# EAGLE schematic Power Distribution Board-B1 (EAGLE 9.6.2)

## Sheet 1 of 5
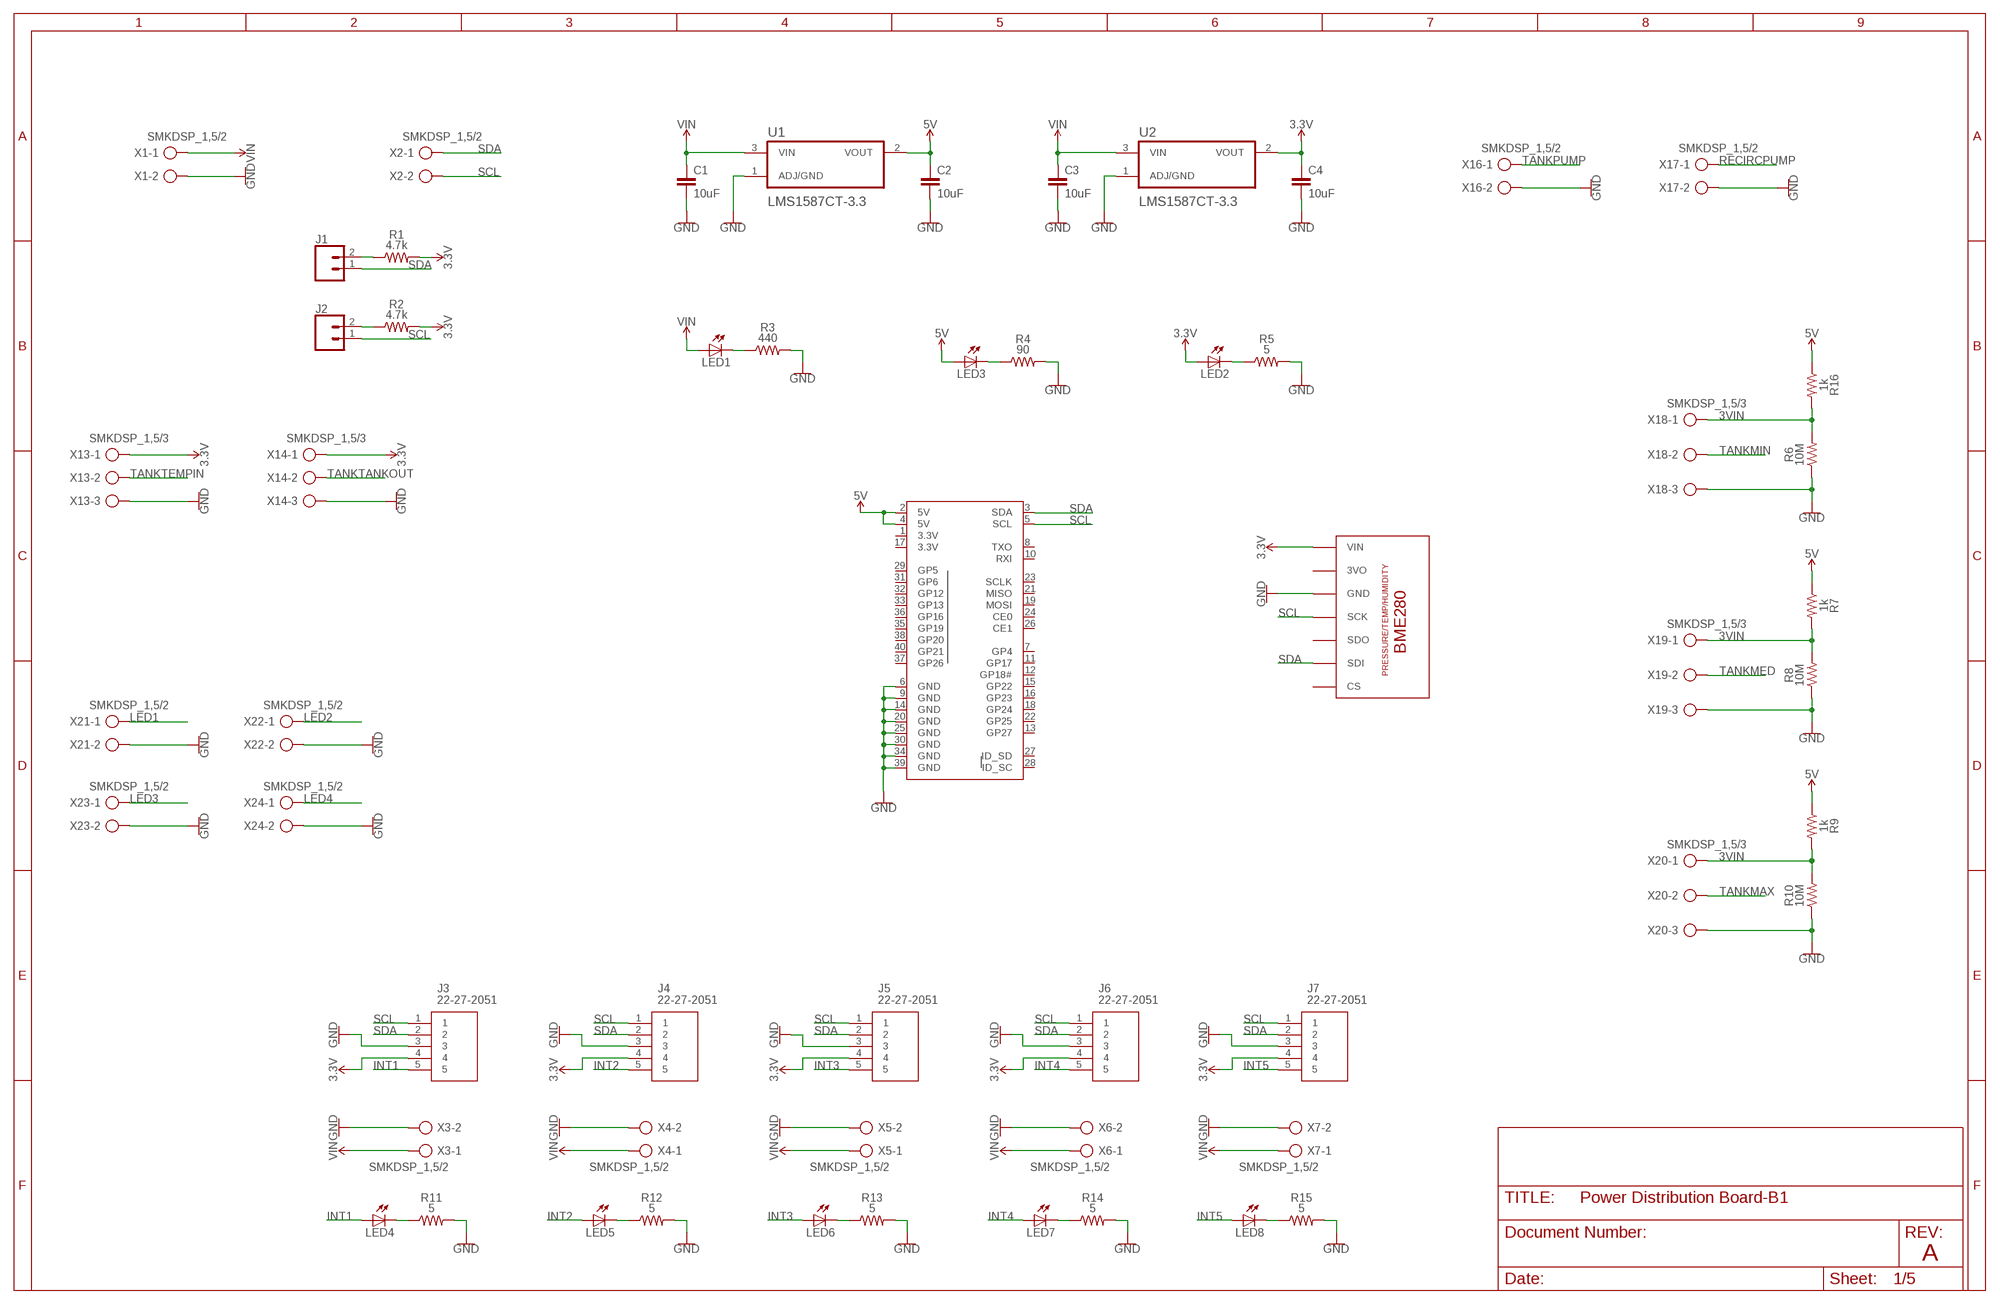
[diagram p0: schematic, sheet 1]

### Parts
C1  10uF  22PF-PTH-2.54MM-200V-5%  [CAP-PTH-2.54]
C2  10uF  22PF-PTH-2.54MM-200V-5%  [CAP-PTH-2.54]
C3  10uF  22PF-PTH-2.54MM-200V-5%  [CAP-PTH-2.54]
C4  10uF  22PF-PTH-2.54MM-200V-5%  [CAP-PTH-2.54]
J1  CONN_02  [1X02]
J2  CONN_02  [1X02]
J3  22-27-2051  [HDRV5W64P0X254_1X5_1270X580X12]
J4  22-27-2051  [HDRV5W64P0X254_1X5_1270X580X12]
J5  22-27-2051  [HDRV5W64P0X254_1X5_1270X580X12]
J6  22-27-2051  [HDRV5W64P0X254_1X5_1270X580X12]
J7  22-27-2051  [HDRV5W64P0X254_1X5_1270X580X12]
LED1  LED5MM  [LED5MM]
LED2  LED5MM  [LED5MM]
LED3  LED5MM  [LED5MM]
LED4  LED5MM  [LED5MM]
LED5  LED5MM  [LED5MM]
LED6  LED5MM  [LED5MM]
LED7  LED5MM  [LED5MM]
LED8  LED5MM  [LED5MM]
R1  4.7k  1MOHM-HORIZ-1/4W-5%  [AXIAL-0.3]
R2  4.7k  1MOHM-HORIZ-1/4W-5%  [AXIAL-0.3]
R3  440  1MOHM-HORIZ-1/4W-5%  [AXIAL-0.3]
R4  90  1MOHM-HORIZ-1/4W-5%  [AXIAL-0.3]
R5  5  1MOHM-HORIZ-1/4W-5%  [AXIAL-0.3]
R6  10M  1MOHM-HORIZ-1/4W-5%  [AXIAL-0.3]
R7  1k  1MOHM-HORIZ-1/4W-5%  [AXIAL-0.3]
R8  10M  1MOHM-HORIZ-1/4W-5%  [AXIAL-0.3]
R9  1k  1MOHM-HORIZ-1/4W-5%  [AXIAL-0.3]
R10  10M  1MOHM-HORIZ-1/4W-5%  [AXIAL-0.3]
R11  5  1MOHM-HORIZ-1/4W-5%  [AXIAL-0.3]
R12  5  1MOHM-HORIZ-1/4W-5%  [AXIAL-0.3]
R13  5  1MOHM-HORIZ-1/4W-5%  [AXIAL-0.3]
R14  5  1MOHM-HORIZ-1/4W-5%  [AXIAL-0.3]
R15  5  1MOHM-HORIZ-1/4W-5%  [AXIAL-0.3]
R16  1k  1MOHM-HORIZ-1/4W-5%  [AXIAL-0.3]
U1  LMS1587CT-3.3  [TO254P1054X470X1955-3]
U2  LMS1587CT-3.3  [TO254P1054X470X1955-3]
U$5  BME280  [BME280]
X1  SMKDSP_1,5/2  [SMKDSP_1,5/2]
X2  SMKDSP_1,5/2  [SMKDSP_1,5/2]
X3  SMKDSP_1,5/2  [SMKDSP_1,5/2]
X4  SMKDSP_1,5/2  [SMKDSP_1,5/2]
X5  SMKDSP_1,5/2  [SMKDSP_1,5/2]
X6  SMKDSP_1,5/2  [SMKDSP_1,5/2]
X7  SMKDSP_1,5/2  [SMKDSP_1,5/2]
X13  SMKDSP_1,5/3  [SMKDSP_1,5/3]
X14  SMKDSP_1,5/3  [SMKDSP_1,5/3]
X15  RASPBERRYPI-40-PIN-GPIO_PTH  [2X20_SHROUDED]
X16  SMKDSP_1,5/2  [SMKDSP_1,5/2]
X17  SMKDSP_1,5/2  [SMKDSP_1,5/2]
X18  SMKDSP_1,5/3  [SMKDSP_1,5/3]
X19  SMKDSP_1,5/3  [SMKDSP_1,5/3]
X20  SMKDSP_1,5/3  [SMKDSP_1,5/3]
X21  SMKDSP_1,5/2  [SMKDSP_1,5/2]
X22  SMKDSP_1,5/2  [SMKDSP_1,5/2]
X23  SMKDSP_1,5/2  [SMKDSP_1,5/2]
X24  SMKDSP_1,5/2  [SMKDSP_1,5/2]

### Nets
3.3V: C4.1 J3.4 J4.4 J5.4 J6.4 J7.4 LED2.A R1.P$2 R2.P$2 U2.2(VOUT) U$5.VIN X13.1 X14.1 ; also sheet 2,3,4,5
3VIN: R6.P$2 R7.P$2 R8.P$2 R9.P$2 R10.P$2 R16.P$2 X18.1 X19.1 X20.1
5V: C2.1 LED3.A R7.P$1 R9.P$1 R16.P$1 U1.2(VOUT) X15.2(5V) X15.4(5V)
GND: C1.2 C2.2 C3.2 C4.2 J3.3 J4.3 J5.3 J6.3 J7.3 R3.P$2 R4.P$2 R5.P$2 R6.P$1 R8.P$1 R10.P$1 R11.P$2 R12.P$2 R13.P$2 R14.P$2 R15.P$2 U1.1(ADJ/GND) U2.1(ADJ/GND) U$5.GND X1.2 X3.2 X4.2 X5.2 X6.2 X7.2 X13.3 X14.3 X15.6(GND) X15.9(GND) X15.14(GND) X15.20(GND) X15.25(GND) X15.30(GND) X15.34(GND) X15.39(GND) X16.2 X17.2 X18.3 X19.3 X20.3 X21.2 X22.2 X23.2 X24.2 ; also sheet 2,3,4,5
INT1: J3.5 LED4.A
INT2: J4.5 LED5.A
INT3: J5.5 LED6.A
INT4: J6.5 LED7.A
INT5: J7.5 LED8.A
LED1: X21.1
LED2: X22.1
LED3: X23.1
LED4: X24.1
N$1: J1.2 R1.P$1
N$2: J2.2 R2.P$1
N$3: LED2.K(C) R5.P$1
N$4: LED1.K(C) R3.P$1
N$5: LED3.K(C) R4.P$1
N$6: LED4.K(C) R11.P$1
N$7: LED5.K(C) R12.P$1
N$8: LED6.K(C) R13.P$1
N$9: LED7.K(C) R14.P$1
N$10: LED8.K(C) R15.P$1
RECIRCPUMP: X17.1
SCL: J2.1 J3.1 J4.1 J5.1 J6.1 J7.1 U$5.SCK X2.2 X15.5(SCL) ; also sheet 2,3,4,5
SDA: J1.1 J3.2 J4.2 J5.2 J6.2 J7.2 U$5.SDI X2.1 X15.3(SDA) ; also sheet 2,3,4,5
TANKMAX: X20.2
TANKMED: X19.2
TANKMIN: X18.2
TANKPUMP: X16.1
TANKTANKOUT: X14.2
TANKTEMPIN: X13.2
VIN: C1.1 C3.1 LED1.A U1.3(VIN) U2.3(VIN) X1.1 X3.1 X4.1 X5.1 X6.1 X7.1
Unconnected: U$5.3VO U$5.CS U$5.SDO X15.7(GP4) X15.8(TXO) X15.10(RXI) X15.11(GP17) X15.12(GP18#) X15.13(GP27) X15.15(GP22) X15.16(GP23) X15.18(GP24) X15.19(MOSI) X15.21(MISO) X15.22(GP25) X15.23(SCLK) X15.24(CE0) X15.26(CE1) X15.27(ID_SD) X15.28(ID_SC) X15.29(GP5) X15.31(GP6) X15.32(GP12) X15.33(GP13) X15.35(GP19) X15.36(GP16) X15.37(GP26) X15.38(GP20) X15.40(GP21)

### Notes on the sheet
- A

## Sheet 2 of 5
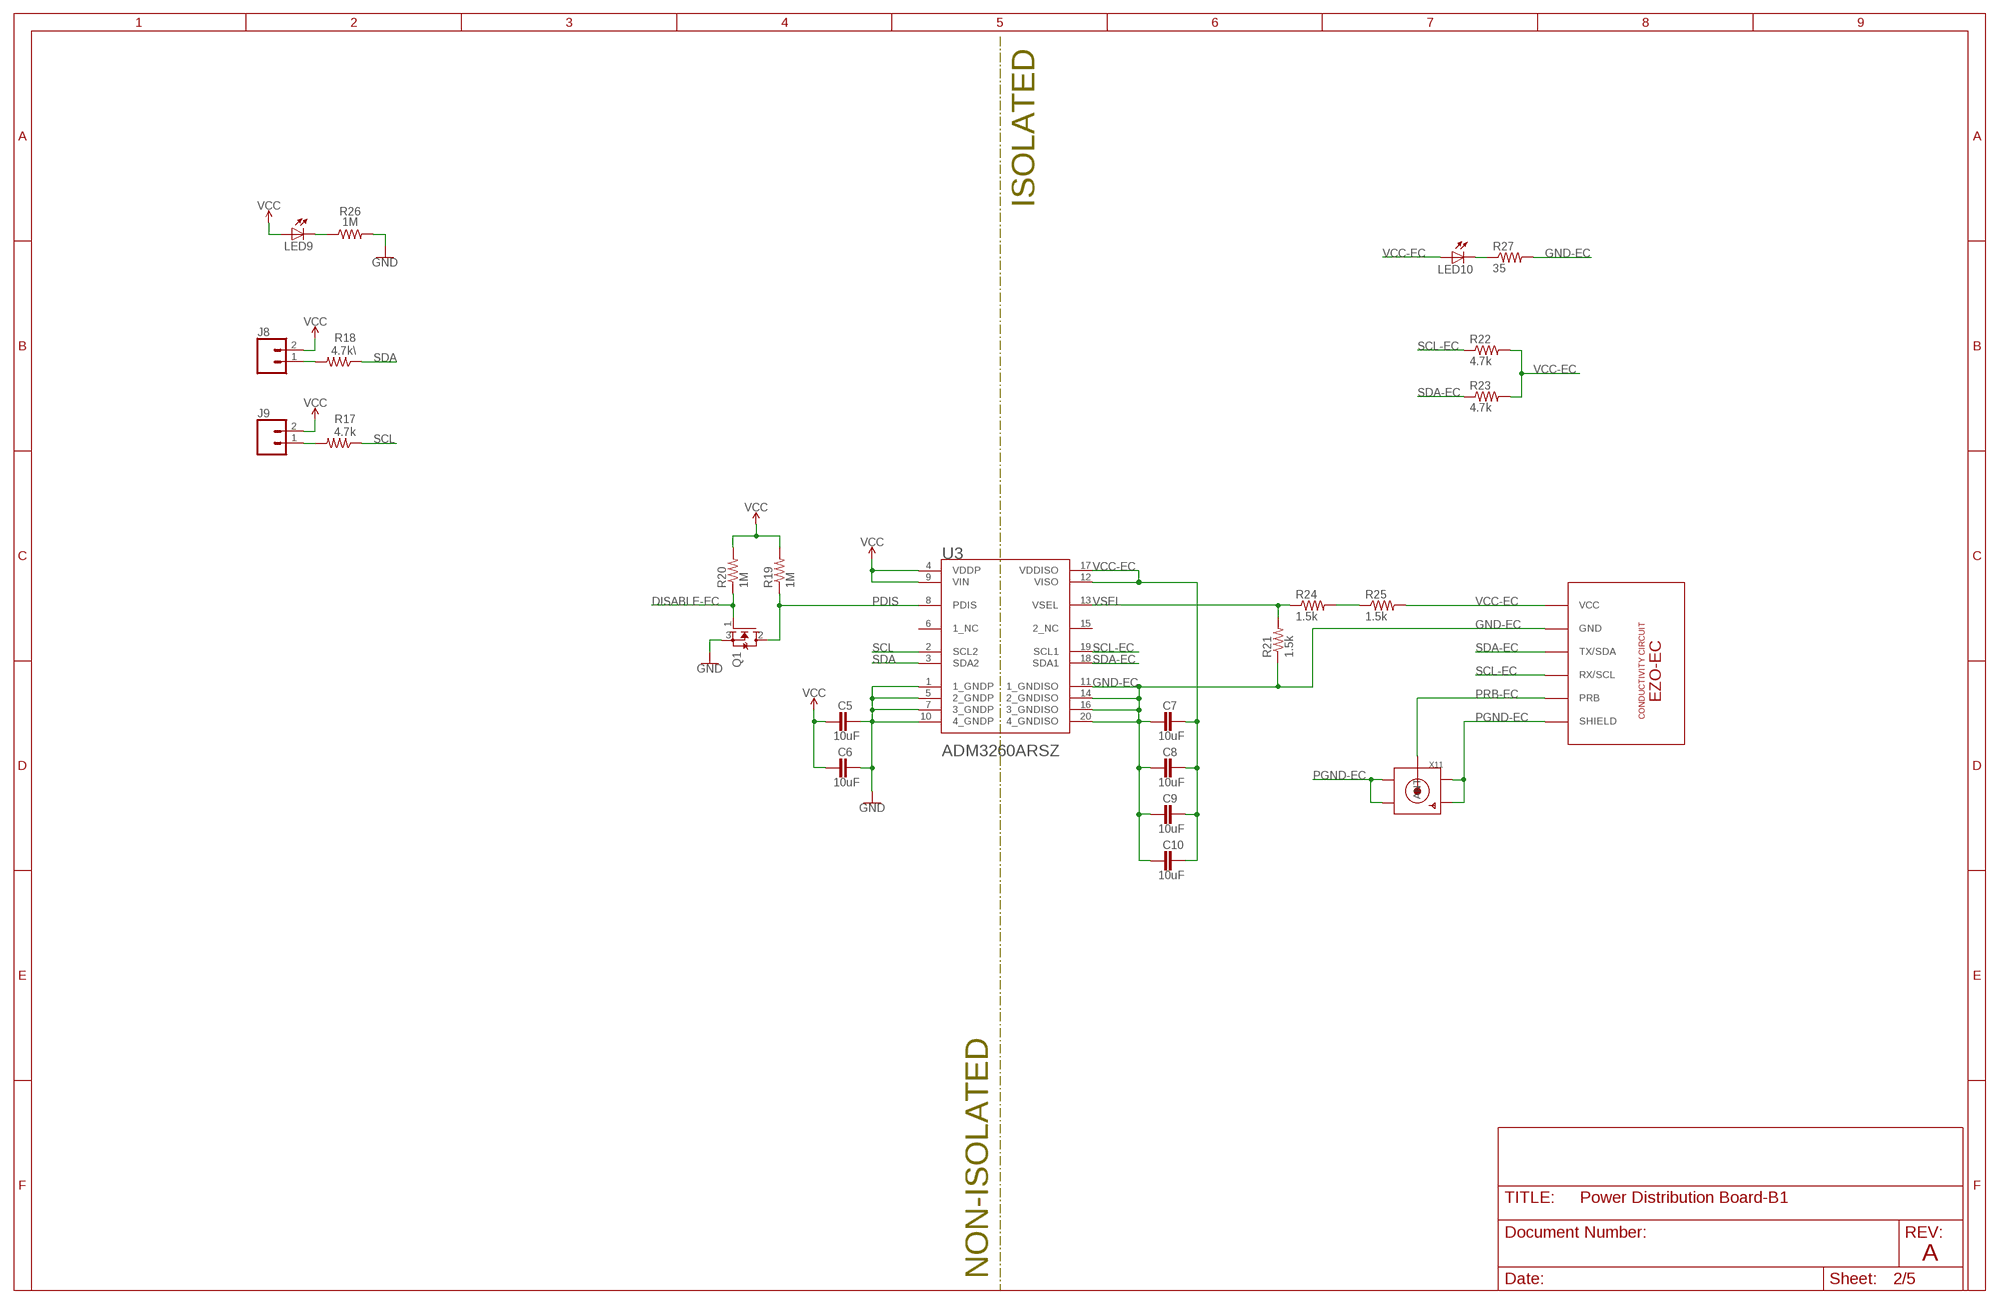
[diagram p1: schematic, sheet 2]

### Parts
C5  10uF  22PF-PTH-2.54MM-200V-5%  [CAP-PTH-2.54]
C6  10uF  22PF-PTH-2.54MM-200V-5%  [CAP-PTH-2.54]
C7  10uF  22PF-PTH-2.54MM-200V-5%  [CAP-PTH-2.54]
C8  10uF  22PF-PTH-2.54MM-200V-5%  [CAP-PTH-2.54]
C9  10uF  22PF-PTH-2.54MM-200V-5%  [CAP-PTH-2.54]
C10  10uF  22PF-PTH-2.54MM-200V-5%  [CAP-PTH-2.54]
J8  CONN_02  [1X02]
J9  CONN_02  [1X02]
LED9  LED5MM  [LED5MM]
LED10  LED5MM  [LED5MM]
Q1  MOSFET-NGDS_TO220V  [TO220V]
R17  4.7k  1MOHM-HORIZ-1/4W-5%  [AXIAL-0.3]
R18  4.7k\  1MOHM-HORIZ-1/4W-5%  [AXIAL-0.3]
R19  1M  1MOHM-HORIZ-1/4W-5%  [AXIAL-0.3]
R20  1M  1MOHM-HORIZ-1/4W-5%  [AXIAL-0.3]
R21  1.5k  1MOHM-HORIZ-1/4W-5%  [AXIAL-0.3]
R22  4.7k  1MOHM-HORIZ-1/4W-5%  [AXIAL-0.3]
R23  4.7k  1MOHM-HORIZ-1/4W-5%  [AXIAL-0.3]
R24  1.5k  1MOHM-HORIZ-1/4W-5%  [AXIAL-0.3]
R25  1.5k  1MOHM-HORIZ-1/4W-5%  [AXIAL-0.3]
R26  1M  1MOHM-HORIZ-1/4W-5%  [AXIAL-0.3]
R27  35  1MOHM-HORIZ-1/4W-5%  [AXIAL-0.3]
U3  ANALOG_DEVICES_INC_ADM3260ARSZANALOG_DEVICES_INC_ADM3260ARSZ_0_0  [ANALOG_DEVICES_INC_ADM3260ARSZ_0]
U$1  EZO-EC  [EZO-EC]
X11  SMACONNECTOR  [SMA90_DIP]

### Nets
3.3V: C5.1 C6.1 LED9.A R19.P$2 R20.P$2 U3.4(VDDP) U3.9(VIN) ; supply symbol labelled VCC ; also sheet 1,3,4,5
DISABLE-EC: Q1.1(G) R20.P$1
GND: C5.2 C6.2 Q1.3(S) R26.P$2 U3.1(1_GNDP) U3.5(2_GNDP) U3.7(3_GNDP) U3.10(4_GNDP) ; also sheet 1,3,4,5
GND-EC: C7.1 C8.1 C9.1 C10.1 R21.P$1 R27.P$2 U3.11(1_GNDISO) U3.14(2_GNDISO) U3.16(3_GNDISO) U3.20(4_GNDISO) U$1.GND
N$12: J9.1 R17.P$2
N$13: R24.P$2 R25.P$1
N$14: LED9.K(C) R26.P$1
N$15: LED10.K(C) R27.P$1
N$18: J8.1 R18.P$2
PDIS: Q1.2(D) R19.P$1 U3.8(PDIS) ; also sheet 3,4,5
PGND-EC: U$1.SHIELD X11.GND1 X11.GND2 X11.GND3 X11.GND4
PRB-EC: U$1.PRB X11.ANTENNA(ANT)
SCL: R17.P$1 U3.2(SCL2) ; also sheet 1,3,4,5
SCL-EC: R22.P$1 U3.19(SCL1) U$1.RX/SCL
SDA: R18.P$1 U3.3(SDA2) ; also sheet 1,3,4,5
SDA-EC: R23.P$1 U3.18(SDA1) U$1.TX/SDA
VCC: J8.2 J9.2 ; also sheet 3,4,5
VCC-EC: C7.2 C8.2 C9.2 C10.2 LED10.A R22.P$2 R23.P$2 R25.P$2 U3.12(VISO) U3.17(VDDISO) U$1.VCC
VSEL: R21.P$2 R24.P$1 U3.13(VSEL) ; also sheet 3,4,5
Unconnected: U3.6(1_NC) U3.15(2_NC)

### Notes on the sheet
- ISOLATED
- A
- NON-ISOLATED

## Sheet 3 of 5
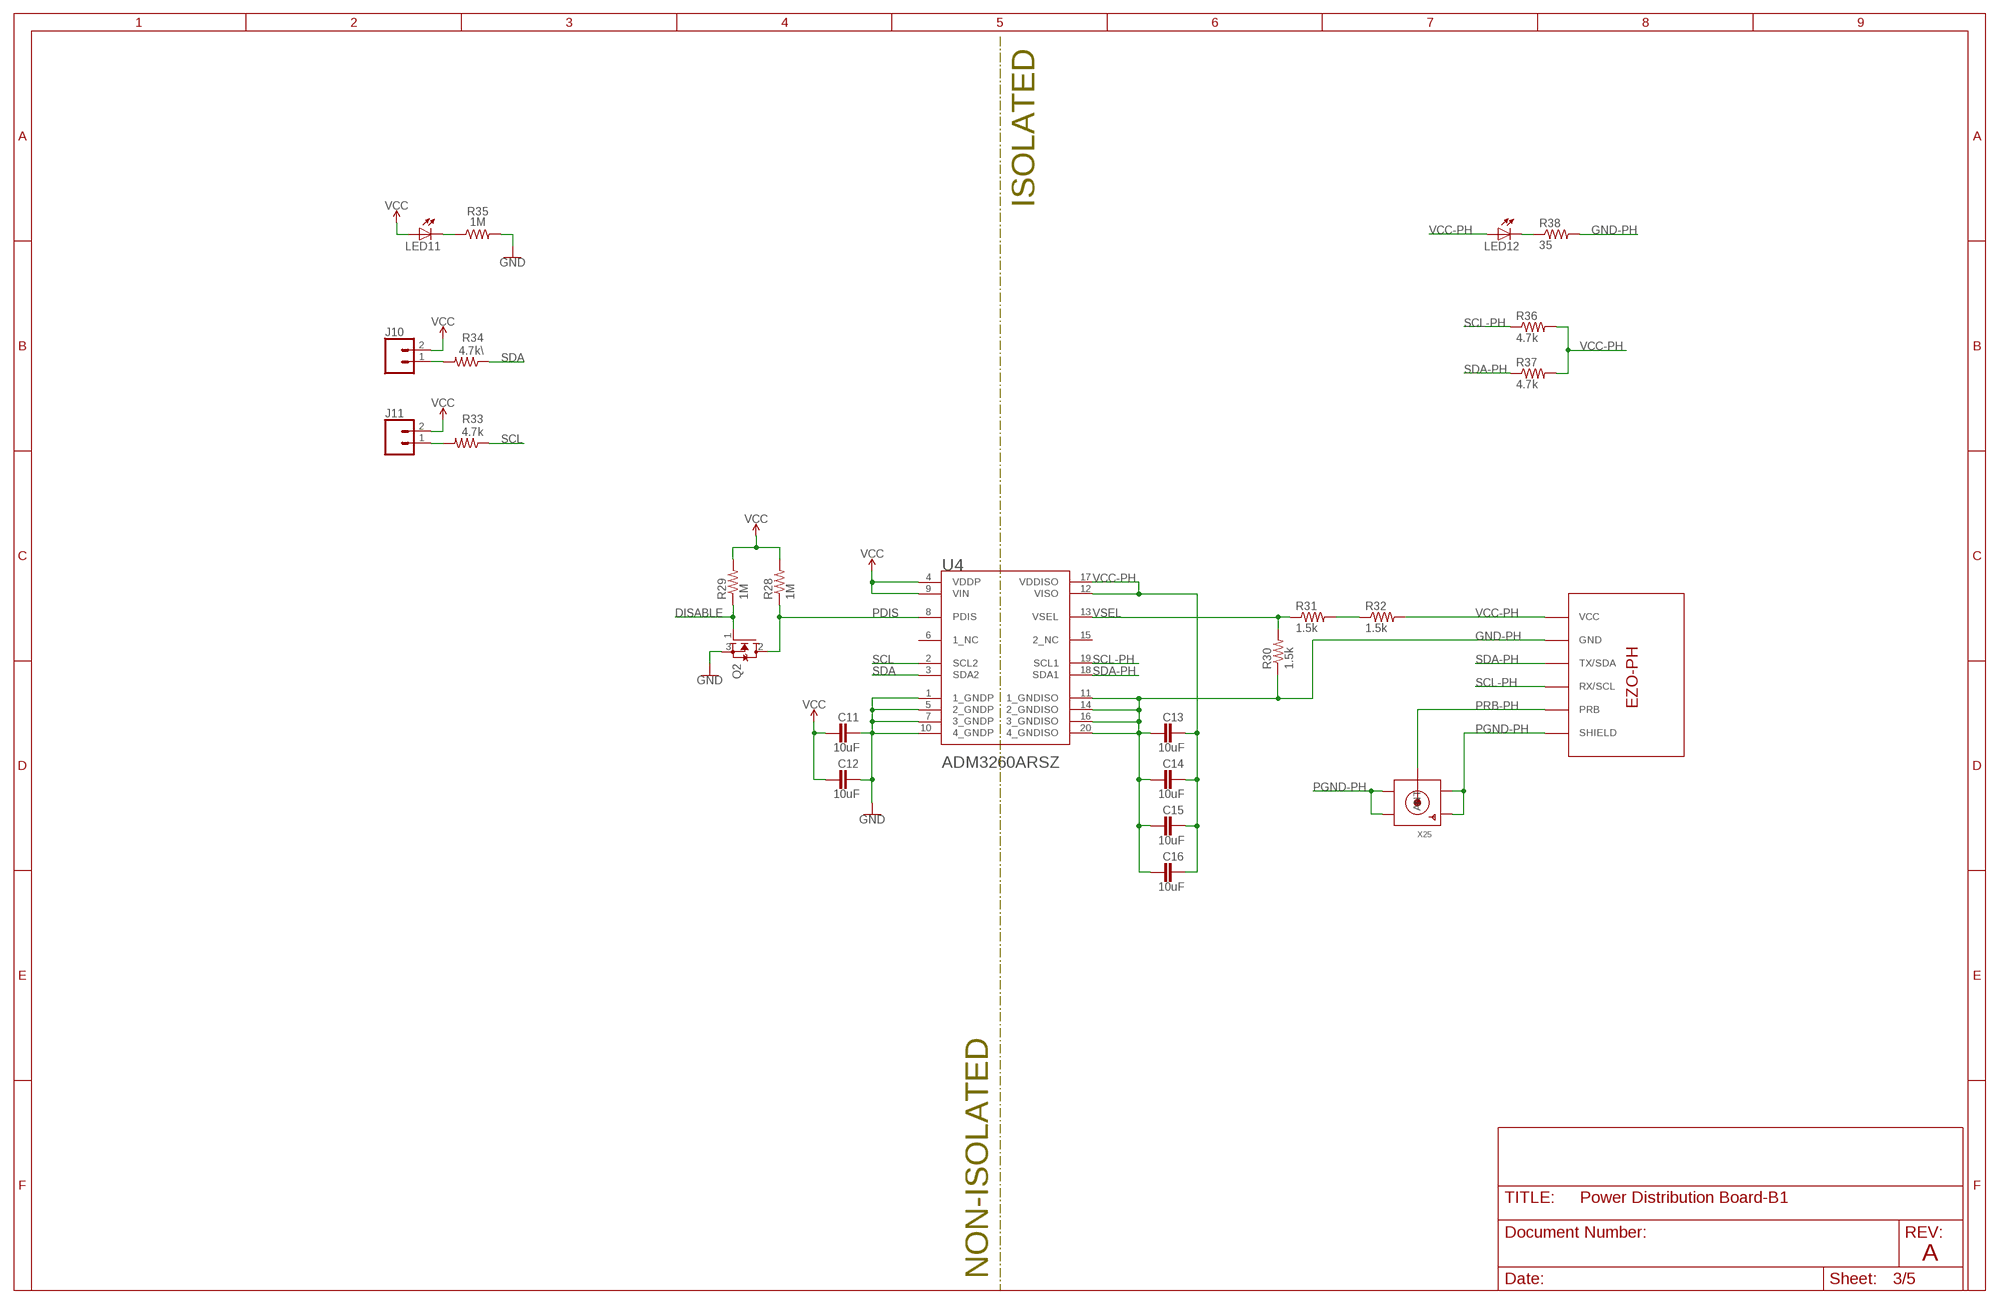
[diagram p2: schematic, sheet 3]

### Parts
C11  10uF  22PF-PTH-2.54MM-200V-5%  [CAP-PTH-2.54]
C12  10uF  22PF-PTH-2.54MM-200V-5%  [CAP-PTH-2.54]
C13  10uF  22PF-PTH-2.54MM-200V-5%  [CAP-PTH-2.54]
C14  10uF  22PF-PTH-2.54MM-200V-5%  [CAP-PTH-2.54]
C15  10uF  22PF-PTH-2.54MM-200V-5%  [CAP-PTH-2.54]
C16  10uF  22PF-PTH-2.54MM-200V-5%  [CAP-PTH-2.54]
J10  CONN_02  [1X02]
J11  CONN_02  [1X02]
LED11  LED5MM  [LED5MM]
LED12  LED5MM  [LED5MM]
Q2  MOSFET-NGDS_TO220V  [TO220V]
R28  1M  1MOHM-HORIZ-1/4W-5%  [AXIAL-0.3]
R29  1M  1MOHM-HORIZ-1/4W-5%  [AXIAL-0.3]
R30  1.5k  1MOHM-HORIZ-1/4W-5%  [AXIAL-0.3]
R31  1.5k  1MOHM-HORIZ-1/4W-5%  [AXIAL-0.3]
R32  1.5k  1MOHM-HORIZ-1/4W-5%  [AXIAL-0.3]
R33  4.7k  1MOHM-HORIZ-1/4W-5%  [AXIAL-0.3]
R34  4.7k\  1MOHM-HORIZ-1/4W-5%  [AXIAL-0.3]
R35  1M  1MOHM-HORIZ-1/4W-5%  [AXIAL-0.3]
R36  4.7k  1MOHM-HORIZ-1/4W-5%  [AXIAL-0.3]
R37  4.7k  1MOHM-HORIZ-1/4W-5%  [AXIAL-0.3]
R38  35  1MOHM-HORIZ-1/4W-5%  [AXIAL-0.3]
U4  ANALOG_DEVICES_INC_ADM3260ARSZANALOG_DEVICES_INC_ADM3260ARSZ_0_0  [ANALOG_DEVICES_INC_ADM3260ARSZ_0]
U$11  EZO-PH  [EZO-PH]
X25  SMACONNECTOR  [SMA90_DIP]

### Nets
3.3V: C11.1 C12.1 U4.4(VDDP) U4.9(VIN) ; supply symbol labelled VCC ; also sheet 1,2,4,5
DISABLE: Q2.1(G) R29.P$1 ; also sheet 4,5
GND: C11.2 C12.2 Q2.3(S) R35.P$2 U4.1(1_GNDP) U4.5(2_GNDP) U4.7(3_GNDP) U4.10(4_GNDP) ; also sheet 1,2,4,5
GND-PH: C13.1 C14.1 C15.1 C16.1 R30.P$1 R38.P$2 U4.11(1_GNDISO) U4.14(2_GNDISO) U4.16(3_GNDISO) U4.20(4_GNDISO) U$11.GND
N$16: LED11.K(C) R35.P$1
N$19: R31.P$2 R32.P$1
N$20: J11.1 R33.P$2
N$21: J10.1 R34.P$2
N$22: LED12.K(C) R38.P$1
PDIS: Q2.2(D) R28.P$1 U4.8(PDIS) ; also sheet 2,4,5
PGND-PH: U$11.SHIELD X25.GND1 X25.GND2 X25.GND3 X25.GND4
PRB-PH: U$11.PRB X25.ANTENNA(ANT)
SCL: R33.P$1 U4.2(SCL2) ; also sheet 1,2,4,5
SCL-PH: R36.P$1 U4.19(SCL1) U$11.RX/SCL
SDA: R34.P$1 U4.3(SDA2) ; also sheet 1,2,4,5
SDA-PH: R37.P$1 U4.18(SDA1) U$11.TX/SDA
VCC: J10.2 J11.2 LED11.A R28.P$2 R29.P$2 ; also sheet 2,4,5
VCC-PH: C13.2 C14.2 C15.2 C16.2 LED12.A R32.P$2 R36.P$2 R37.P$2 U4.12(VISO) U4.17(VDDISO) U$11.VCC
VSEL: R30.P$2 R31.P$1 U4.13(VSEL) ; also sheet 2,4,5
Unconnected: U4.6(1_NC) U4.15(2_NC)

### Notes on the sheet
- ISOLATED
- A
- NON-ISOLATED

## Sheet 4 of 5
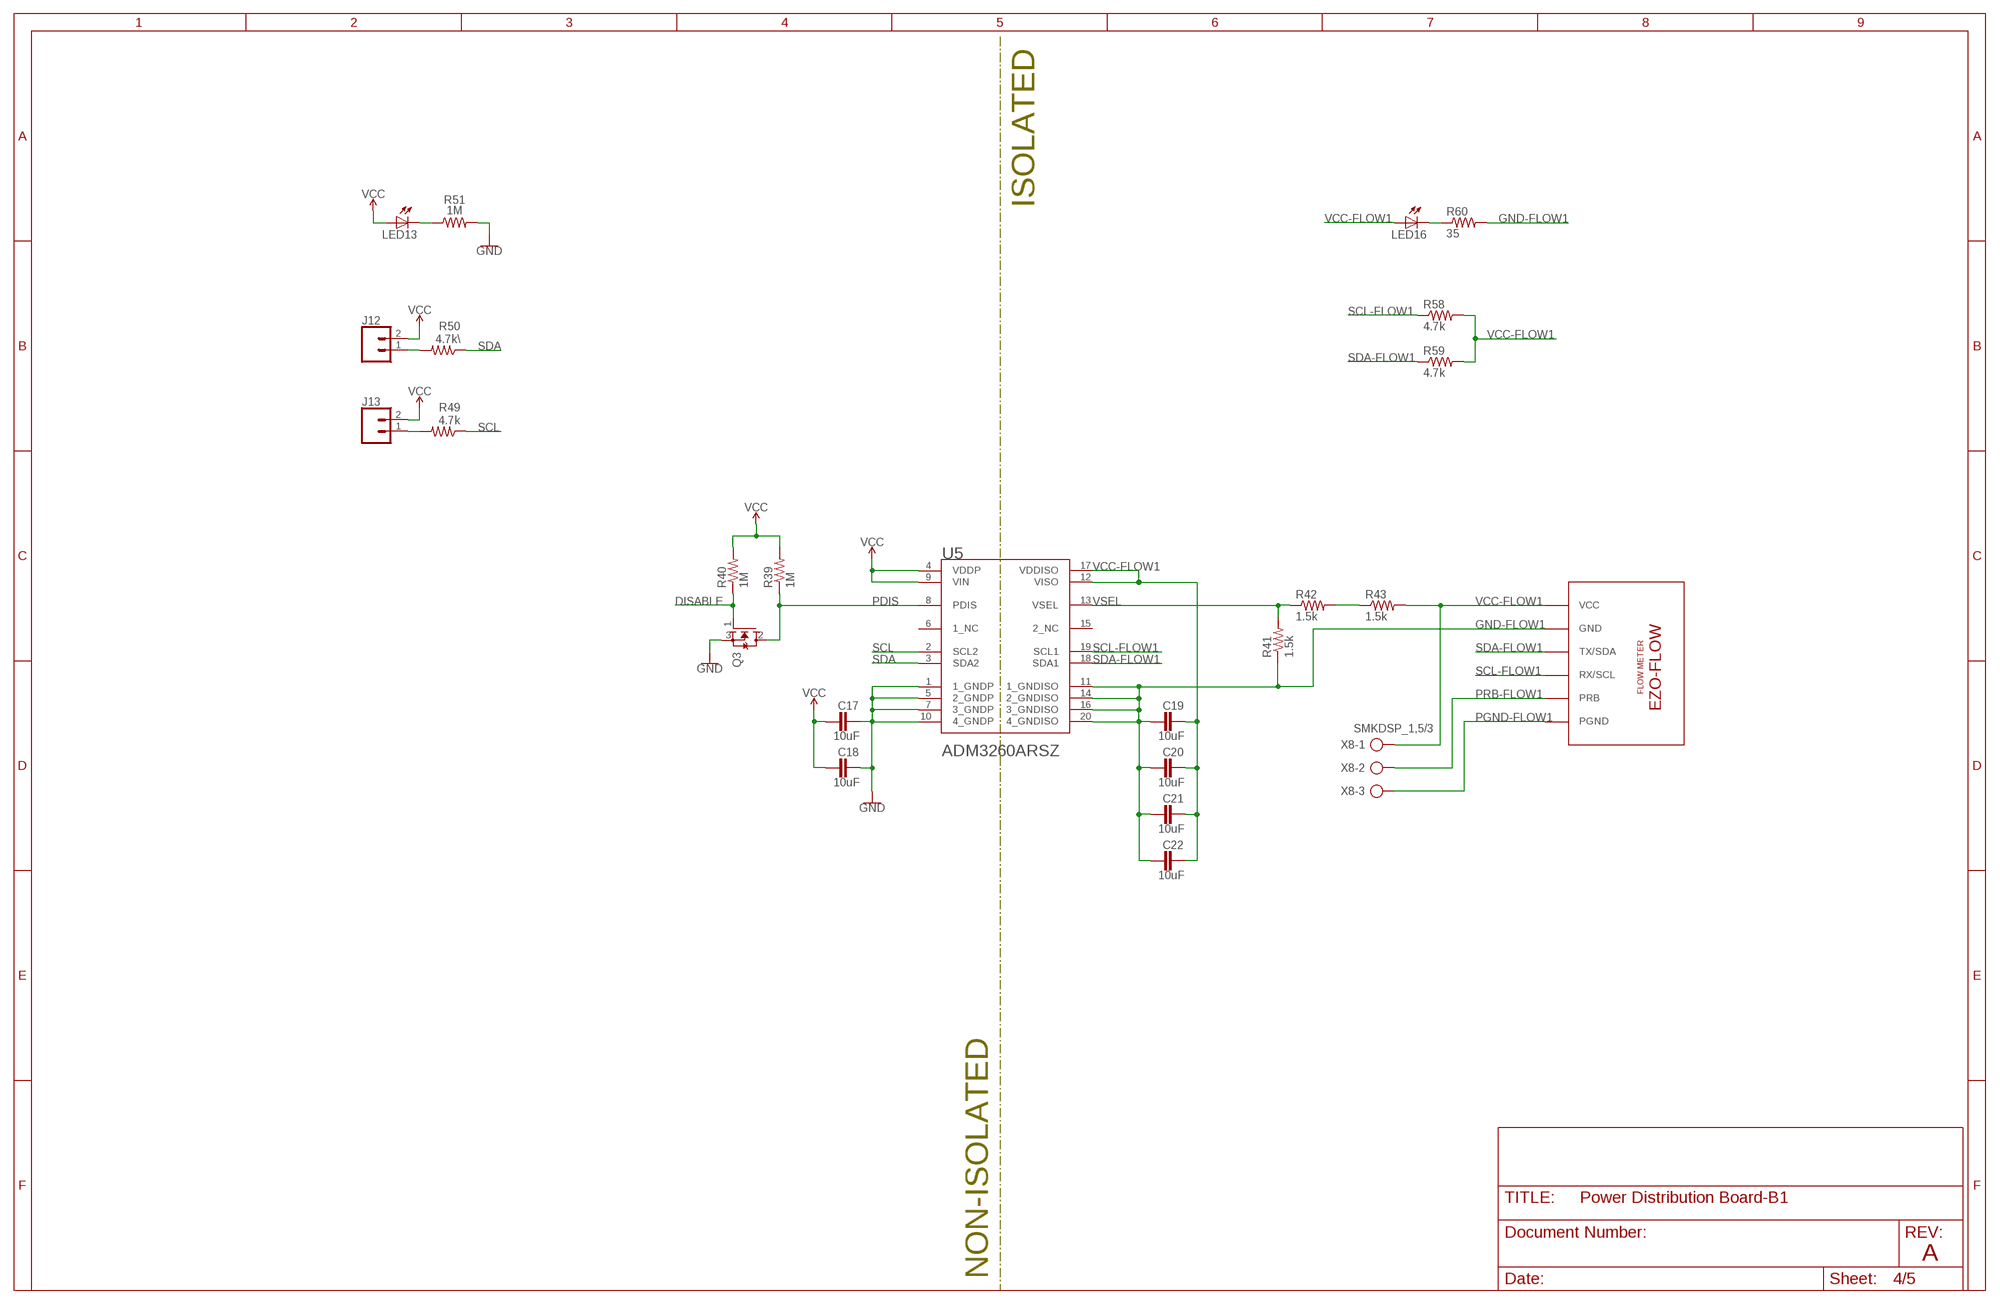
[diagram p3: schematic, sheet 4]

### Parts
C17  10uF  22PF-PTH-2.54MM-200V-5%  [CAP-PTH-2.54]
C18  10uF  22PF-PTH-2.54MM-200V-5%  [CAP-PTH-2.54]
C19  10uF  22PF-PTH-2.54MM-200V-5%  [CAP-PTH-2.54]
C20  10uF  22PF-PTH-2.54MM-200V-5%  [CAP-PTH-2.54]
C21  10uF  22PF-PTH-2.54MM-200V-5%  [CAP-PTH-2.54]
C22  10uF  22PF-PTH-2.54MM-200V-5%  [CAP-PTH-2.54]
J12  CONN_02  [1X02]
J13  CONN_02  [1X02]
LED13  LED5MM  [LED5MM]
LED16  LED5MM  [LED5MM]
Q3  MOSFET-NGDS_TO220V  [TO220V]
R39  1M  1MOHM-HORIZ-1/4W-5%  [AXIAL-0.3]
R40  1M  1MOHM-HORIZ-1/4W-5%  [AXIAL-0.3]
R41  1.5k  1MOHM-HORIZ-1/4W-5%  [AXIAL-0.3]
R42  1.5k  1MOHM-HORIZ-1/4W-5%  [AXIAL-0.3]
R43  1.5k  1MOHM-HORIZ-1/4W-5%  [AXIAL-0.3]
R49  4.7k  1MOHM-HORIZ-1/4W-5%  [AXIAL-0.3]
R50  4.7k\  1MOHM-HORIZ-1/4W-5%  [AXIAL-0.3]
R51  1M  1MOHM-HORIZ-1/4W-5%  [AXIAL-0.3]
R58  4.7k  1MOHM-HORIZ-1/4W-5%  [AXIAL-0.3]
R59  4.7k  1MOHM-HORIZ-1/4W-5%  [AXIAL-0.3]
R60  35  1MOHM-HORIZ-1/4W-5%  [AXIAL-0.3]
U5  ANALOG_DEVICES_INC_ADM3260ARSZANALOG_DEVICES_INC_ADM3260ARSZ_0_0  [ANALOG_DEVICES_INC_ADM3260ARSZ_0]
U$2  EZO-FLOW  [EZO-FLOW]
X8  SMKDSP_1,5/3  [SMKDSP_1,5/3]

### Nets
3.3V: C17.1 C18.1 LED13.A R39.P$2 R40.P$2 U5.4(VDDP) U5.9(VIN) ; supply symbol labelled VCC ; also sheet 1,2,3,5
DISABLE: Q3.1(G) R40.P$1 ; also sheet 3,5
GND: C17.2 C18.2 Q3.3(S) R51.P$2 U5.1(1_GNDP) U5.5(2_GNDP) U5.7(3_GNDP) U5.10(4_GNDP) ; also sheet 1,2,3,5
GND-FLOW1: C19.1 C20.1 C21.1 C22.1 R41.P$1 R60.P$2 U5.11(1_GNDISO) U5.14(2_GNDISO) U5.16(3_GNDISO) U5.20(4_GNDISO) U$2.GND
N$24: R42.P$2 R43.P$1
N$29: LED13.K(C) R51.P$1
N$30: J13.1 R49.P$2
N$31: J12.1 R50.P$2
N$36: LED16.K(C) R60.P$1
PDIS: Q3.2(D) R39.P$1 U5.8(PDIS) ; also sheet 2,3,5
PGND-FLOW1: U$2.PGND X8.3
PRB-FLOW1: U$2.PRB X8.2
SCL: R49.P$1 U5.2(SCL2) ; also sheet 1,2,3,5
SCL-FLOW1: R58.P$1 U5.19(SCL1) U$2.RX/SCL
SDA: R50.P$1 U5.3(SDA2) ; also sheet 1,2,3,5
SDA-FLOW1: R59.P$1 U5.18(SDA1) U$2.TX/SDA
VCC: J12.2 J13.2 ; also sheet 2,3,5
VCC-FLOW1: C19.2 C20.2 C21.2 C22.2 LED16.A R43.P$2 R58.P$2 R59.P$2 U5.12(VISO) U5.17(VDDISO) U$2.VCC X8.1
VSEL: R41.P$2 R42.P$1 U5.13(VSEL) ; also sheet 2,3,5
Unconnected: U5.6(1_NC) U5.15(2_NC)

### Notes on the sheet
- ISOLATED
- A
- NON-ISOLATED

## Sheet 5 of 5
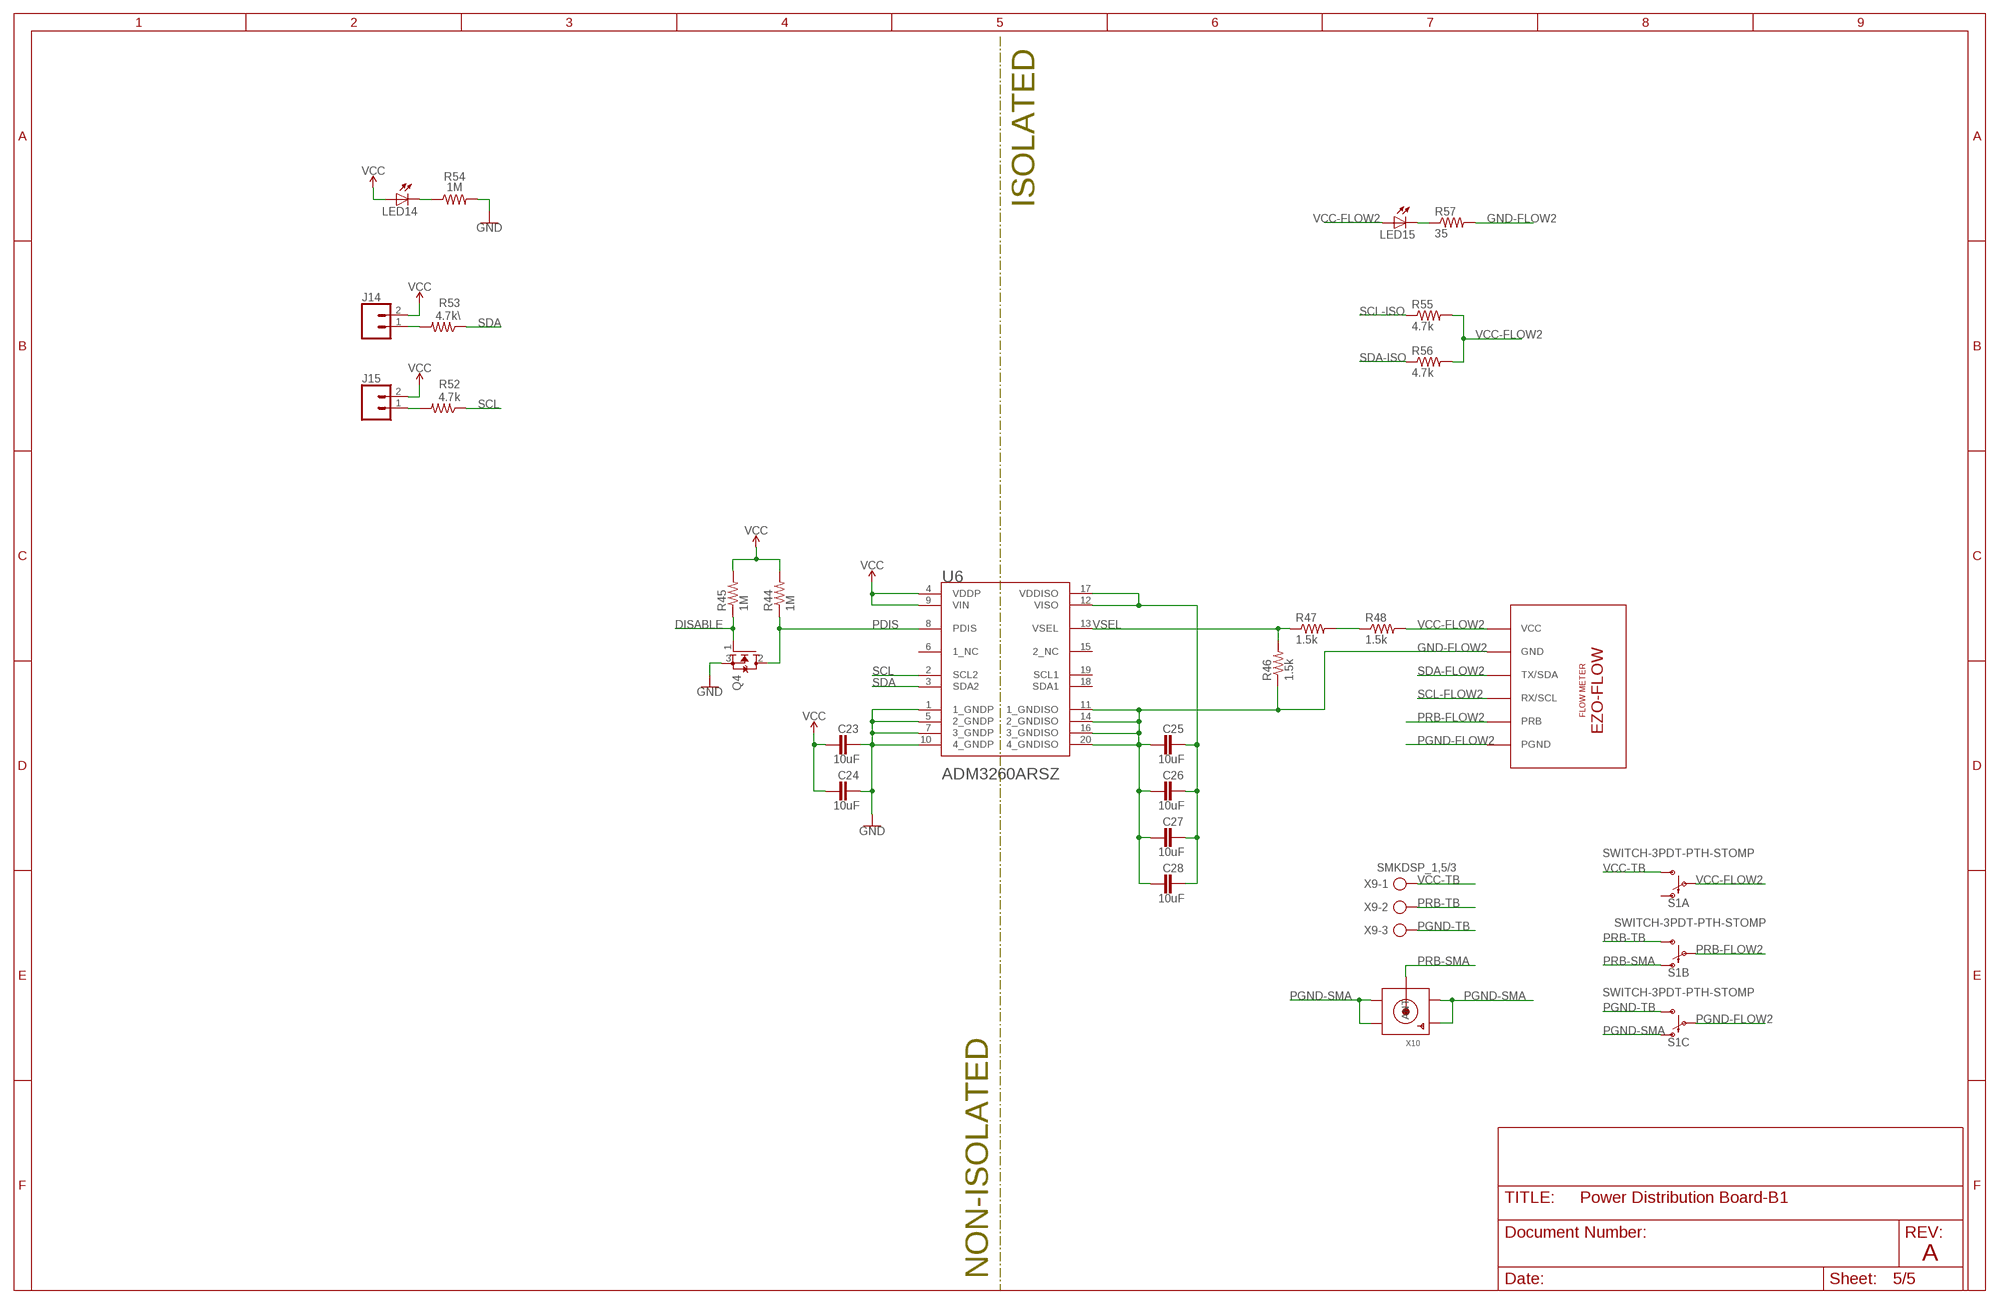
[diagram p4: schematic, sheet 5]

### Parts
C23  10uF  22PF-PTH-2.54MM-200V-5%  [CAP-PTH-2.54]
C24  10uF  22PF-PTH-2.54MM-200V-5%  [CAP-PTH-2.54]
C25  10uF  22PF-PTH-2.54MM-200V-5%  [CAP-PTH-2.54]
C26  10uF  22PF-PTH-2.54MM-200V-5%  [CAP-PTH-2.54]
C27  10uF  22PF-PTH-2.54MM-200V-5%  [CAP-PTH-2.54]
C28  10uF  22PF-PTH-2.54MM-200V-5%  [CAP-PTH-2.54]
J14  CONN_02  [1X02]
J15  CONN_02  [1X02]
LED14  LED5MM  [LED5MM]
LED15  LED5MM  [LED5MM]
Q4  MOSFET-NGDS_TO220V  [TO220V]
R44  1M  1MOHM-HORIZ-1/4W-5%  [AXIAL-0.3]
R45  1M  1MOHM-HORIZ-1/4W-5%  [AXIAL-0.3]
R46  1.5k  1MOHM-HORIZ-1/4W-5%  [AXIAL-0.3]
R47  1.5k  1MOHM-HORIZ-1/4W-5%  [AXIAL-0.3]
R48  1.5k  1MOHM-HORIZ-1/4W-5%  [AXIAL-0.3]
R52  4.7k  1MOHM-HORIZ-1/4W-5%  [AXIAL-0.3]
R53  4.7k\  1MOHM-HORIZ-1/4W-5%  [AXIAL-0.3]
R54  1M  1MOHM-HORIZ-1/4W-5%  [AXIAL-0.3]
R55  4.7k  1MOHM-HORIZ-1/4W-5%  [AXIAL-0.3]
R56  4.7k  1MOHM-HORIZ-1/4W-5%  [AXIAL-0.3]
R57  35  1MOHM-HORIZ-1/4W-5%  [AXIAL-0.3]
S1  SWITCH-3PDT-PTH-STOMP  [STOMP_SWITCH_3PDT]
U6  ANALOG_DEVICES_INC_ADM3260ARSZANALOG_DEVICES_INC_ADM3260ARSZ_0_0  [ANALOG_DEVICES_INC_ADM3260ARSZ_0]
U$4  EZO-FLOW  [EZO-FLOW]
X9  SMKDSP_1,5/3  [SMKDSP_1,5/3]
X10  SMACONNECTOR  [SMA90_DIP]

### Nets
3.3V: C23.1 C24.1 LED14.A R44.P$2 R45.P$2 U6.4(VDDP) U6.9(VIN) ; supply symbol labelled VCC ; also sheet 1,2,3,4
DISABLE: Q4.1(G) R45.P$1 ; also sheet 3,4
GND: C23.2 C24.2 Q4.3(S) R54.P$2 U6.1(1_GNDP) U6.5(2_GNDP) U6.7(3_GNDP) U6.10(4_GNDP) ; also sheet 1,2,3,4
GND-FLOW2: C25.1 C26.1 C27.1 C28.1 R46.P$1 R57.P$2 U6.11(1_GNDISO) U6.14(2_GNDISO) U6.16(3_GNDISO) U6.20(4_GNDISO) U$4.GND
N$27: R47.P$2 R48.P$1
N$28: C25.2 C26.2 C27.2 C28.2 U6.12(VISO) U6.17(VDDISO)
N$32: LED14.K(C) R54.P$1
N$33: J15.1 R52.P$2
N$34: J14.1 R53.P$2
N$35: LED15.K(C) R57.P$1
PDIS: Q4.2(D) R44.P$1 U6.8(PDIS) ; also sheet 2,3,4
PGND-FLOW2: S1.P$8(C:P) U$4.PGND
PGND-SMA: S1.P$7(C:O) X10.GND1 X10.GND2 X10.GND3 X10.GND4
PGND-TB: S1.P$9(C:S) X9.3
PRB-FLOW2: S1.P$5(B:P) U$4.PRB
PRB-SMA: S1.P$4(B:O) X10.ANTENNA(ANT)
PRB-TB: S1.P$6(B:S) X9.2
SCL: R52.P$1 U6.2(SCL2) ; also sheet 1,2,3,4
SCL-FLOW2: U$4.RX/SCL
SCL-ISO: R55.P$1
SDA: R53.P$1 U6.3(SDA2) ; also sheet 1,2,3,4
SDA-FLOW2: U$4.TX/SDA
SDA-ISO: R56.P$1
VCC: J14.2 J15.2 ; also sheet 2,3,4
VCC-FLOW2: LED15.A R48.P$2 R55.P$2 R56.P$2 S1.P$2(A:P) U$4.VCC
VCC-TB: S1.P$3(A:S) X9.1
VSEL: R46.P$2 R47.P$1 U6.13(VSEL) ; also sheet 2,3,4
Unconnected: S1.P$1(A:O) U6.6(1_NC) U6.15(2_NC) U6.18(SDA1) U6.19(SCL1)

### Notes on the sheet
- ISOLATED
- A
- NON-ISOLATED

## Power pins joined to a net without a drawn wire
3.3V: X15.1(3.3V) X15.17(3.3V)

## Library data of the parts
C1-C28 = SparkFun-Capacitors:22PF: 22pF ceramic capacitors A capacitor is a passive two-terminal electrical component used to store electrical energy temporarily in an electric field.; PROD_ID: CAP-09128; VALUE: 22pF
J1 J2 J8-J15 = SparkFun-Connectors:CONN_02: Multi connection point. Often used as Generic Header-pin footprint for 0.1 inch spaced/style header connections On any of the 0.1 inch spaced packages, you can populate with these: Break Away Headers - Straight (PRT-00116) Break Away Male Headers - Right Angle (PRT-00553) Female Headers (PRT-00115) Break Away Headers - Machine Pin (PRT-00117) Break Away Female Headers - Swiss Machine Pin (PRT-00743) For SCREWTERMINALS and SPRING TERMINALS visit here: Screw Terimnals on SparkFun.com (5mm/3.5mm/2.54mm spacing) This device is also useful as a general connection point to wire up your design to another part of your project. Our various solder wires solder well into these plated through hole pads. Hook-Up Wire - Assortment (Stranded, 22 AWG) (PRT-11375) Hook-Up Wire - Assortment (Solid Core, 22 AWG) (PRT-11367) View the entire wire category on our website here Special notes: Molex polarized connector foot print use with: PRT-08233 with associated crimp pins and housings. 2.54_SCREWTERM for use with PRT-10571. 3.5mm Screw Terminal footprints for PRT-08084 5mm Screw Terminal footprints for use with PRT-08432
J3-J7 = 22-27-2051:22-27-2051: Headers & Wire Housings 6410 5X1 HEADER Source: Datasheet; DESCRIPTION: Headers & Wire Housings 6410 5X1 HEADER; HEIGHT: 12.05mm; MANUFACTURER_NAME: Molex; MANUFACTURER_PART_NUMBER: 22-27-2051
LED1-LED16 = adafruit:LED: LED OSRAM: - CHIPLED LG R971, LG N971, LY N971, LG Q971, LY Q971, LO R971, LY R971 LH N974, LH R974 LS Q976, LO Q976, LY Q976 LO Q996 - Hyper CHIPLED LW Q18S LB Q993, LB Q99A, LB R99A - SideLED LS A670, LO A670, LY A670, LG A670, LP A670 LB A673, LV A673, LT A673, LW A673 LH A674 LY A675 LS A676, LA A676, LO A676, LY A676, LW A676 LS A679, LY A679, LG A679 - Hyper Micro SIDELED® LS Y876, LA Y876, LO Y876, LY Y876 LT Y87S - SmartLED LW L88C, LW L88S LB L89C, LB L89S, LG L890 LS L89K, LO L89K, LY L89K LS L896, LA L896, LO L896, LY L896 - TOPLED LS T670, LO T670, LY T670, LG T670, LP T670 LSG T670, LSP T670, LSY T670, LOP T670, LYG T670 LG T671, LOG T671, LSG T671 LB T673, LV T673, LT T673, LW T673 LH T674 LS T676, LA T676, LO T676, LY T676, LB T676, LH T676, LSB T676, LW T676 LB T67C, LV T67C, LT T67C, LS T67K, LO T67K, LY T67K, LW E67C LS E67B, LA E67B, LO E67B, LY E67B, LB E67C, LV E67C, LT E67C LW T67C LS T679, LY T679, LG T679 LS T770, LO T770, LY T770, LG T770, LP T770 LB T773, LV T773, LT T773, LW T773 LH T774 LS E675, LA E675, LY E675, LS T675 LS T776, LA T776, LO T776, LY T776, LB T776 LHGB T686 LT T68C, LB T68C - Hyper Mini TOPLED® LB M676 - Mini TOPLED Santana® LG M470 LS M47K, LO M47K, LY M47K Source: http://www.osram.convergy.de/
Q1-Q4 = adafruit:MOSFET-N: N-Channel Mosfet 2N7002E - 60V 260mA SOT23 [Digikey: 2N7002ET1GOSTR-ND] - REEL BSH103 - 30V 850mA SOT23 [Digikey: 568-5013-1-ND]
R1-R18 R21-R25 R27 R30-R34 R36-R38 R41-R43 R46-R50 R52 R53 R55-R60 = SparkFun-Resistors:1MOHM: 1MΩ resistor A resistor is a passive two-terminal electrical component that implements electrical resistance as a circuit element. Resistors act to reduce current flow, and, at the same time, act to lower voltage levels within circuits. - Wikipedia; PROD_ID: RES-09329; VALUE: 1M
R19 R20 R26 R28 R29 R35 R39 R40 R44 R45 R51 R54 = SparkFun-Resistors:1MOHM: 1MΩ resistor A resistor is a passive two-terminal electrical component that implements electrical resistance as a circuit element. Resistors act to reduce current flow, and, at the same time, act to lower voltage levels within circuits. - Wikipedia; PROD_ID: RES-09329
S1 = SparkFun-Switches:SWITCH-3PDT: 3-Pole, Double-Throw (3PDT) Switch Three-pole, double-throw stomp switch. Drawn as three separate gates for schematic clarity. SparkFun Products Used in SparkFun Proto Pedal (PRT-13124); PROD_ID: SWCH-13197
U1 U2 = LMS1587CT-3.3:LMS1587CT-3.3; DESCRIPTION: 3-A, 13-V, linear voltage regulator 3-TO-220 0 to 125; DIGI-KEY_PART_NUMBER: LMS1587CT-3.3/NOPB-ND; MF: Texas Instruments; MP: LMS1587CT-3.3/NOPB; PACKAGE: TO-220-3 Texas Instruments; PURCHASE-URL: https://pricing.snapeda.com/search/part/LMS1587CT-3.3/NOPB/?ref=eda
U3-U6 = Analog Devices Inc - ADM3260ARSZ:ANALOG_DEVICES_INC_ADM3260ARSZ: Digital Isolator, 2 Channel, 3 V, 5.5 V, SSOP, 20 Pins; AMBIENT_TEMPERATURE_RANGE_HIGH: +105°C; AMBIENT_TEMPERATURE_RANGE_LOW: -40°C; CENTROID_NOT_SPECIFIED: No; DATASHEET: http://www.analog.com/media/en/technical-documentation/data-sheets/ADM3260.pdf; DEVICE_CLASS_L1: Integrated Circuits (ICs); DEVICE_CLASS_L2: Power Management ICs; DEVICE_CLASS_L3: Hot Swap Controllers; DIGIKEY_DESCRIPTION: IC DGTL ISO 2.5KV 2CH I2C 20SSOP; DIGIKEY_PART_NUMBER: ADM3260ARSZ-ND; FOOTPRINT_PARAMETERS_0: {"fp_type":"SSOP","params":{"N":{"nom":20,"long name":"Number of leads","min":null,"max":null,"short name":"N","type":"count"},"A":{"nom":false,"long name":"Height","min":false,"max":2000000,"short name":"A","type":"measurement"},"A1":{"nom":false,"long name":"Package clearance","min":50000,"max":false,"short name":"A1","type":"measurement"},"A2":{"nom":1750000,"long name":"Package height","min":1650000,"max":1850000,"short name":"A2","type":"measurement"},"E":{"nom":7800000,"long name":"Width /w leads","min":7400000,"max":8200000,"short name":"E","type":"measurement"},"E1":{"nom":5300000,"long name":"Package width","min":5000000,"max":5600000,"short name":"E1","type":"measurement"},"D":{"nom":7200000,"long name":"Package length","min":6900000,"max":7500000,"short name":"D","type":"measurement"},"B":{"nom":false,"long name":"Lead width","min":220000,"max":380000,"short name":"B","type":"measurement"},"C":{"nom":false,"long name":"Lead thickness","min":90000,"max":250000,"short name":"C","type":"measurement"},"L":{"nom":750000,"long name":"Lead foot length","min":550000,"max":950000,"short name":"L","type":"measurement"},"e":{"nom":650000,"long name":"Lead pitch","min":null,"max":null,"short name":"e","type":"measurement"},"PHI":{"nom":false,"long name":"Lead angle","min":0,"max":8,"short name":"PHI","type":"measurement"},"HT":{"default":"No","long name":"Thermal pad","type":"multichoiceparent","short name":"HT","children":[]},"offset x":{"nom":0,"long name":"X Center offset","min":null,"max":null,"short name":"offset x","type":"measurement"},"offset y":{"nom":0,"long name":"Y Center offset","min":null,"max":null,"short name":"offset y","type":"measurement"},"LS":{"default":"Rounded rectangle","long name":"Land shape","type":"multichoice","short name":"LS"},"LS1":{"default":"Rectangle","long name":"Land shape (Pin 1)","type":"multichoice","short name":"LS1"},"solder toe":{"nom":150000,"long name":"Solder fillet (toe)","min":null,"max":null,"short name":"solder toe","type":"fixedmeasurement"},"solder heel":{"nom":250000,"long name":"Solder fillet (heel)","min":null,"max":null,"short name":"solder heel","type":"fixedmeasurement"},"solder side":{"nom":10000,"long name":"Solder fillet (side)","min":null,"max":null,"short name":"solder side","type":"fixedmeasurement"},"courtyard":{"nom":100000,"long name":"Courtyard","min":null,"max":null,"short name":"courtyard","type":"fixedmeasurement"},"SF":{"default":"C","long name":"Packing level","type":"multichoiceparent","short name":"SF","help":"http://support.upverter.com/customer/portal/articles/978783-what-is-a-footprint-packing-level","children":["solder toe","solder heel","solder side","courtyard"]}}}; HEIGHT: 2mm; IPC_LAND_PATTERN_NAME: SOP65P780X200-20; LEAD_FREE: yes; MAX_SUPPLY_VOLTAGE: 5.5V; MF: Analog Devices Inc; MFG_PACKAGE_IDENT: RS-20; MFG_PACKAGE_IDENT_DATE: 0; MFG_PACKAGE_IDENT_REV: A; MIN_SUPPLY_VOLTAGE: 3V; MOUSER_DESCRIPTION: Digital Isolators Iso, Dual I2C w/DC to DC conv; MOUSER_PART_NUMBER: 584-ADM3260ARSZ; MPN: ADM3260ARSZ; NUMBER_OF_CHANNELS: 2; NUMBER_OF_OUTPUTS: 2; OUTPUT_CURRENT: 30mA; OUTPUT_VOLTAGE: 3-5.5V; PACKAGE: SSOP20; PIN_0_0_3_INSIDE_EDGE: clock; PIN_0_0_4_INSIDE_EDGE: clock; PREFIX: U; ROHS: yes; STANDOFF_HEIGHT: 0.05mm; TEMPERATURE_RANGE_HIGH: +105°C; TEMPERATURE_RANGE_LOW: -40°C; VERIFICATION_VERSION: 0.0.0.1
U$1 = EZO:EZO-EC
U$2 U$4 = EZO:EZO-FLOW
U$5 = Bosch:BME280
U$11 = EZO:EZO-PH
X1-X7 X16 X17 X21-X24 = con-phoenix-smkdsp:SMKDSP_1,5/2: Printklemme, Nennstrom: 17,5 A, Bemessungsspannung: 250 V, Raster: 5,0 mm Source: http://eshop.phoenixcontact.de .. 1733415.pdf; MF: FARNELL; MPN: 1733570; OC_FARNELL: 3041244; OC_NEWARK: 69C8588
X8 X9 X13 X14 X18-X20 = con-phoenix-smkdsp:SMKDSP_1,5/3: Printklemme, Nennstrom: 17,5 A, Bemessungsspannung: 250 V, Raster: 5,0 mm Source: http://eshop.phoenixcontact.de .. 1733415.pdf; MF: FARNELL; MPN: 1733583; OC_FARNELL: 3041256; OC_NEWARK: 71C4130
X10 X11 X25 = adafruit:SMACONNECTOR: SMA Connector 90° DIP SMA Connector, 50 Ohm (4UConnector: 07259)
X15 = SparkFun-Connectors:RASPBERRYPI-40-PIN-GPIO: Raspberry Pi GPIO Header 2x20 pin connector, as found on B, B+, A+ models. Both shrouded PTH and SMT versions available. SparkFun Products: GPIO Shrouded Header <https://www.sparkfun.com/products/13054>- PTH SparkFun Pi Wedge (Preassembled) <https://www.sparkfun.com/products/13717>; PROD_ID: CONN-12263; SF_ID: PRT-13054